# EAGLE design Remote (EAGLE 9.4.2)
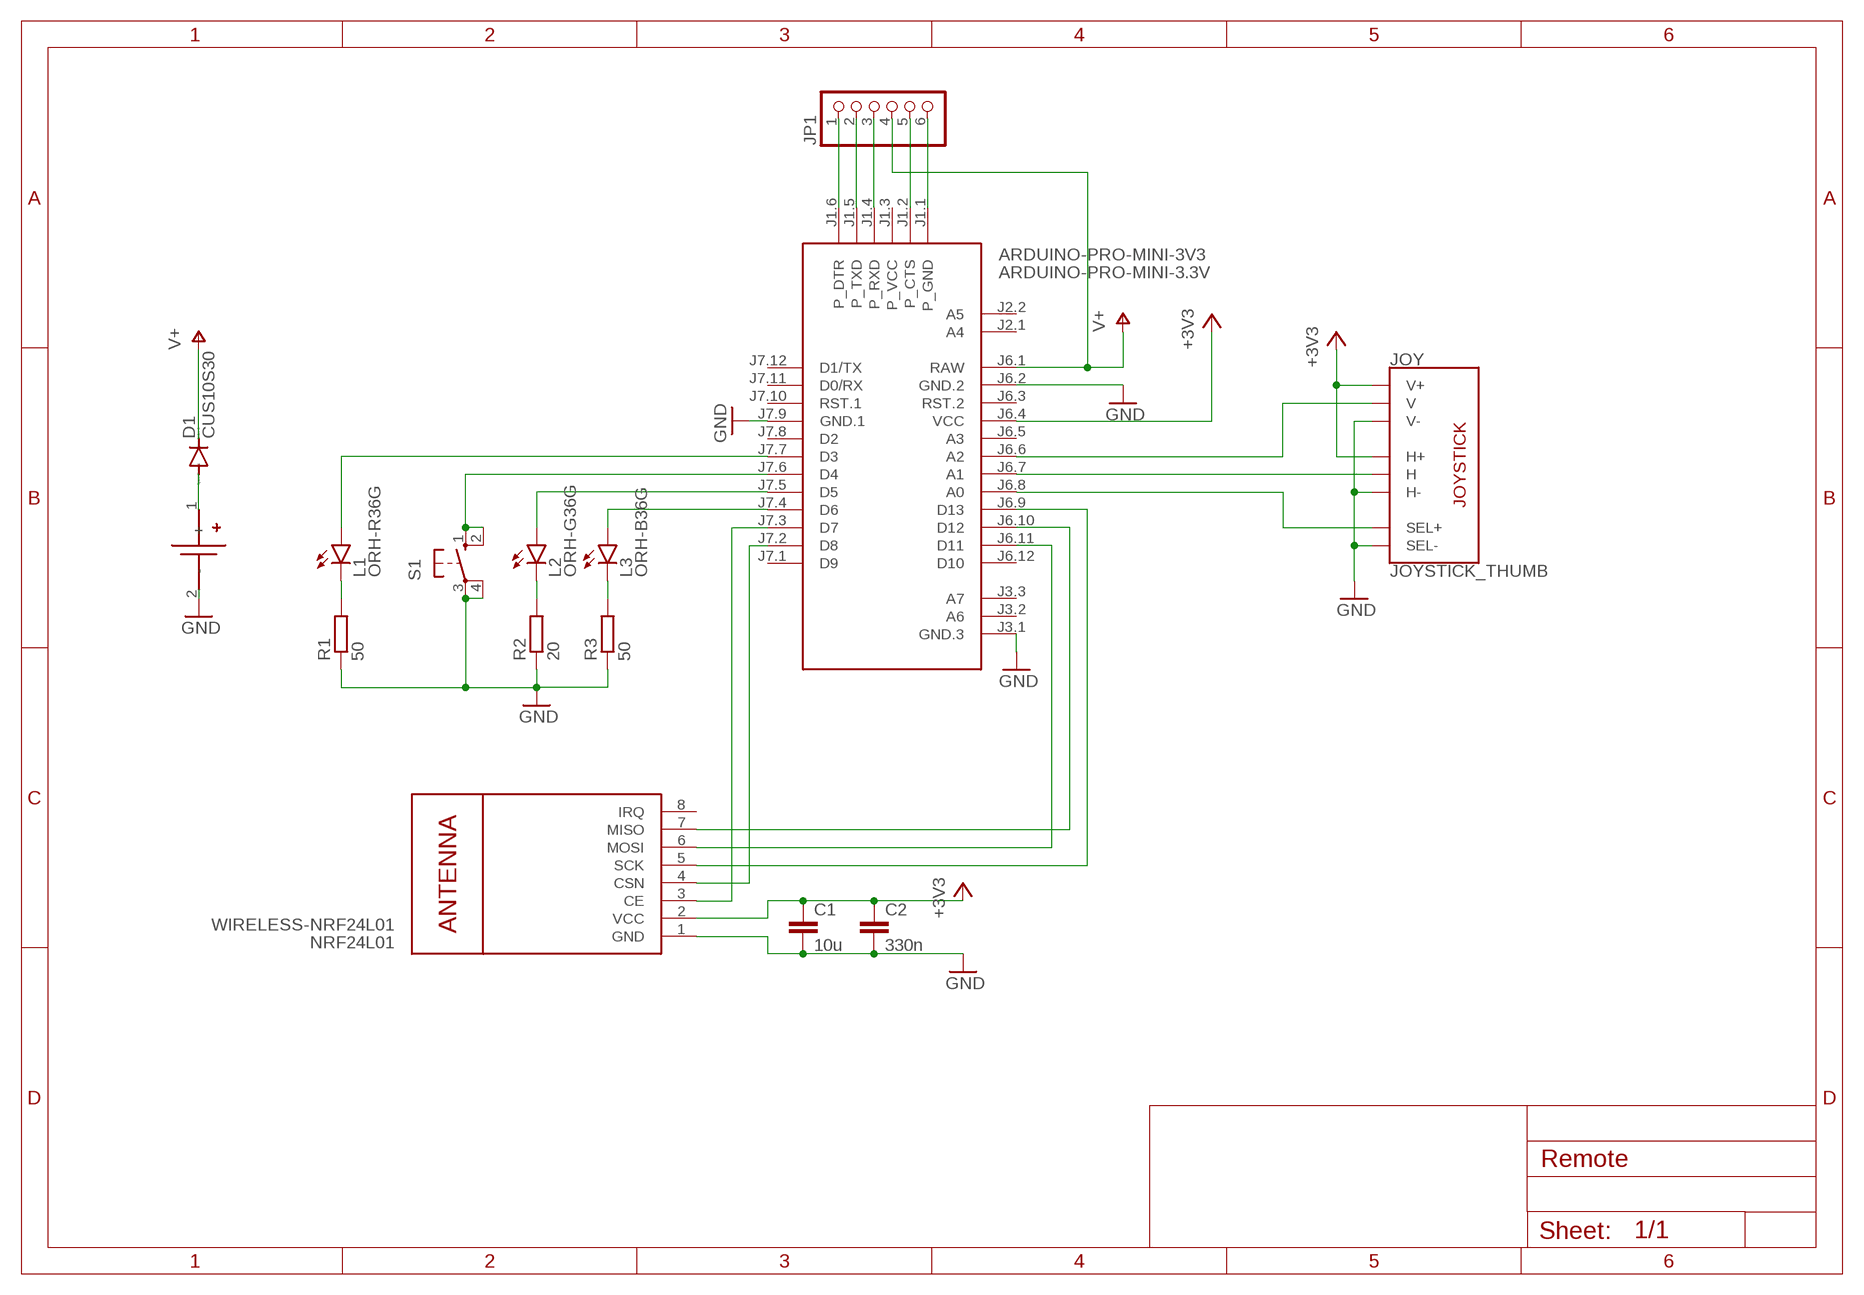
[diagram p0: schematic, sheet 1]

## Parts
ARDUINO-PRO-MINI-3V3  ARDUINO-PRO-MINI-3.3V  [ARDUINO-PRO-MINI]
C1  10u  C-EUC0805  [C0805]
C2  330n  C-EUC0805  [C0805]
D1  CUS10S30  DIODE-SOD323-W  [SOD323-W]
JOY  JOYSTICK_THUMB  [JOYSTICK]
JP1  PINHD-1X6  [1X06]
L1  ORH-R36G  LEDCHIP-LED0603  [CHIP-LED0603]
L2  ORH-G36G  LEDCHIP-LED0603  [CHIP-LED0603]
L3  ORH-B36G  LEDCHIP-LED0603  [CHIP-LED0603]
NRF24L01  WIRELESS-NRF24L01  [WIRELESS-NRF24L01]
R1  50  R-EU_R0603  [R0603]
R2  20  R-EU_R0603  [R0603]
R3  50  R-EU_R0603  [R0603]
S1  10-XX  [B3F-10XX]
U$2  BLOSSOM-BLM-18650-1PCSNO-SCREWS  [BLOSSOM-BLM-18650-1PCS-NO-SCREWS-SMALL-HOLES]

## Nets
+3V3: ARDUINO-PRO-MINI-3V3.J6.4(VCC) C1.1 C2.1 JOY.H1(H+) JOY.V1(V+) NRF24L01.2(VCC)
GND: ARDUINO-PRO-MINI-3V3.J3.1(GND.3) ARDUINO-PRO-MINI-3V3.J6.2(GND.2) ARDUINO-PRO-MINI-3V3.J7.9(GND.1) C1.2 C2.2 JOY.B2A(SEL-) JOY.H3(H-) JOY.V3(V-) NRF24L01.1(GND) R1.1 R2.1 R3.1 S1.3(P) S1.4(P1) U$2.2(-)
N$1: D1.A U$2.1(+)
N$2: ARDUINO-PRO-MINI-3V3.J7.7(D3) L1.A
N$3: ARDUINO-PRO-MINI-3V3.J7.5(D5) L2.A
N$4: ARDUINO-PRO-MINI-3V3.J7.3(D7) NRF24L01.3(CE)
N$5: ARDUINO-PRO-MINI-3V3.J7.2(D8) NRF24L01.4(CSN)
N$6: ARDUINO-PRO-MINI-3V3.J6.9(D13) NRF24L01.5(SCK)
N$7: ARDUINO-PRO-MINI-3V3.J6.11(D11) NRF24L01.6(MOSI)
N$8: ARDUINO-PRO-MINI-3V3.J6.10(D12) NRF24L01.7(MISO)
N$9: ARDUINO-PRO-MINI-3V3.J6.8(A0) JOY.B1A(SEL+)
N$10: ARDUINO-PRO-MINI-3V3.J6.7(A1) JOY.H2(H)
N$11: ARDUINO-PRO-MINI-3V3.J6.6(A2) JOY.V2(V)
N$12: ARDUINO-PRO-MINI-3V3.J7.4(D6) L3.A
N$13: L3.C R3.2
N$14: L2.C R2.2
N$15: L1.C R1.2
N$16: ARDUINO-PRO-MINI-3V3.J1.6(P_DTR) JP1.1
N$17: ARDUINO-PRO-MINI-3V3.J1.5(P_TXD) JP1.2
N$18: ARDUINO-PRO-MINI-3V3.J1.4(P_RXD) JP1.3
N$19: ARDUINO-PRO-MINI-3V3.J7.6(D4) S1.1(S) S1.2(S1)
N$20: ARDUINO-PRO-MINI-3V3.J1.2(P_CTS) JP1.5
N$21: ARDUINO-PRO-MINI-3V3.J1.1(P_GND) JP1.6
V+: ARDUINO-PRO-MINI-3V3.J6.1(RAW) D1.C JP1.4
Unconnected: ARDUINO-PRO-MINI-3V3.J1.3(P_VCC) ARDUINO-PRO-MINI-3V3.J2.1(A4) ARDUINO-PRO-MINI-3V3.J2.2(A5) ARDUINO-PRO-MINI-3V3.J3.2(A6) ARDUINO-PRO-MINI-3V3.J3.3(A7) ARDUINO-PRO-MINI-3V3.J6.3(RST.2) ARDUINO-PRO-MINI-3V3.J6.5(A3) ARDUINO-PRO-MINI-3V3.J6.12(D10) ARDUINO-PRO-MINI-3V3.J7.1(D9) ARDUINO-PRO-MINI-3V3.J7.8(D2) ARDUINO-PRO-MINI-3V3.J7.10(RST.1) ARDUINO-PRO-MINI-3V3.J7.11(D0/RX) ARDUINO-PRO-MINI-3V3.J7.12(D1/TX) NRF24L01.8(IRQ)

## Library data of the parts
ARDUINO-PRO-MINI-3V3 = diy-modules:ARDUINO-PRO-MINI-*: Arduino Pro Mini and compatible devices More details available here: https://www.arduino.cc/en/Main/ArduinoBoardProMini Click here to find device on ebay.com <http://www.ebay.com/sch/arduino+pro+mini>
C1 C2 = rcl:C-EU: CAPACITOR, European symbol; SPICEPREFIX: C
D1 = diode:DIODE-: DIODE
JOY = SparkFun-Switches:JOYSTICK_THUMB: Analog Thumb Joystick This is a joystick very similar to the ‘analog’ joysticks on PS2 (PlayStation 2) controllers. Directional movements are simply two potentiometers - one for each axis. Pots are ~10k each. This joystick also has a select button that is actuated when the joystick is pressed down. SparkFun Products Thumb Joystick <https://www.sparkfun.com/products/9032> (COM-09032) SparkFun Thumb Joystick Breakout <https://www.sparkfun.com/products/9110> (BOB-09110) SparkFun Joystick Shield Kit <https://www.sparkfun.com/products/9760> (DEV-09760); PROD_ID: COMP-09744; SF_SKU: COM-09032
JP1 = pinhead:PINHD-1X6: PIN HEADER
L1-L3 = led:LED: LED OSRAM: - CHIPLED LG R971, LG N971, LY N971, LG Q971, LY Q971, LO R971, LY R971 LH N974, LH R974 LS Q976, LO Q976, LY Q976 LO Q996 - Hyper CHIPLED LW Q18S LB Q993, LB Q99A, LB R99A - SideLED LS A670, LO A670, LY A670, LG A670, LP A670 LB A673, LV A673, LT A673, LW A673 LH A674 LY A675 LS A676, LA A676, LO A676, LY A676, LW A676 LS A679, LY A679, LG A679 - Hyper Micro SIDELED® LS Y876, LA Y876, LO Y876, LY Y876 LT Y87S - SmartLED LW L88C, LW L88S LB L89C, LB L89S, LG L890 LS L89K, LO L89K, LY L89K LS L896, LA L896, LO L896, LY L896 - TOPLED LS T670, LO T670, LY T670, LG T670, LP T670 LSG T670, LSP T670, LSY T670, LOP T670, LYG T670 LG T671, LOG T671, LSG T671 LB T673, LV T673, LT T673, LW T673 LH T674 LS T676, LA T676, LO T676, LY T676, LB T676, LH T676, LSB T676, LW T676 LB T67C, LV T67C, LT T67C, LS T67K, LO T67K, LY T67K, LW E67C LS E67B, LA E67B, LO E67B, LY E67B, LB E67C, LV E67C, LT E67C LW T67C LS T679, LY T679, LG T679 LS T770, LO T770, LY T770, LG T770, LP T770 LB T773, LV T773, LT T773, LW T773 LH T774 LS E675, LA E675, LY E675, LS T675 LS T776, LA T776, LO T776, LY T776, LB T776 LHGB T686 LT T68C, LB T68C - Hyper Mini TOPLED® LB M676 - Mini TOPLED Santana® LG M470 LS M47K, LO M47K, LY M47K Source: http://www.osram.convergy.de LUXEON: - LUMILED® LXK2-PW12-R00, LXK2-PW12-S00, LXK2-PW14-U00, LXK2-PW14-V00 LXK2-PM12-R00, LXK2-PM12-S00, LXK2-PM14-U00 LXK2-PE12-Q00, LXK2-PE12-R00, LXK2-PE12-S00, LXK2-PE14-T00, LXK2-PE14-U00 LXK2-PB12-K00, LXK2-PB12-L00, LXK2-PB12-M00, LXK2-PB14-N00, LXK2-PB14-P00, LXK2-PB14-Q00 LXK2-PR12-L00, LXK2-PR12-M00, LXK2-PR14-Q00, LXK2-PR14-R00 LXK2-PD12-Q00, LXK2-PD12-R00, LXK2-PD12-S00 LXK2-PH12-R00, LXK2-PH12-S00 LXK2-PL12-P00, LXK2-PL12-Q00, LXK2-PL12-R00 Source: www.luxeon.com KINGBRIGHT: KA-3528ASYC Source: www.kingbright.com
NRF24L01 = diy-modules:WIRELESS-NRF24L01: 2.4 GHz Wireless Module based on NRF24L01 chip More details available here: http://www.electrodragon.com/w/NRF24L01 Click here to find device on ebay.com <http://www.ebay.com/sch/nrf24l01+arduino>
R1-R3 = rcl:R-EU_: RESISTOR, European symbol; SPICEPREFIX: R
S1 = switch-omron:10-XX: OMRON SWITCH; MPN: B3F-1000; OC_FARNELL: 176432; OC_NEWARK: 36M3542
U$2 = battery-holders-modified:BLOSSOM-BLM-18650-1PCS

## Board
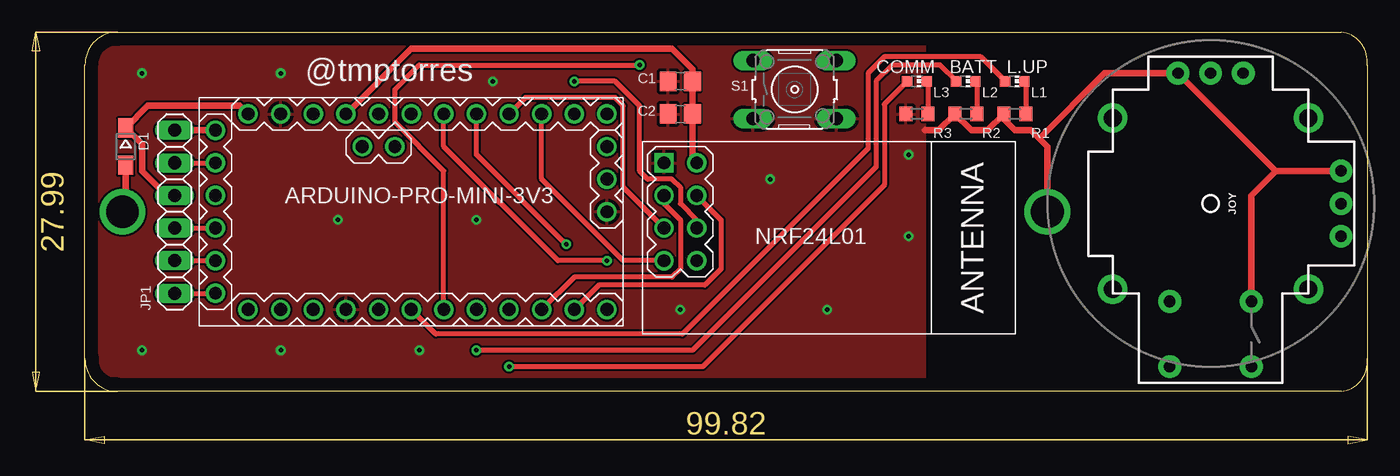
[diagram p1: board, top side]
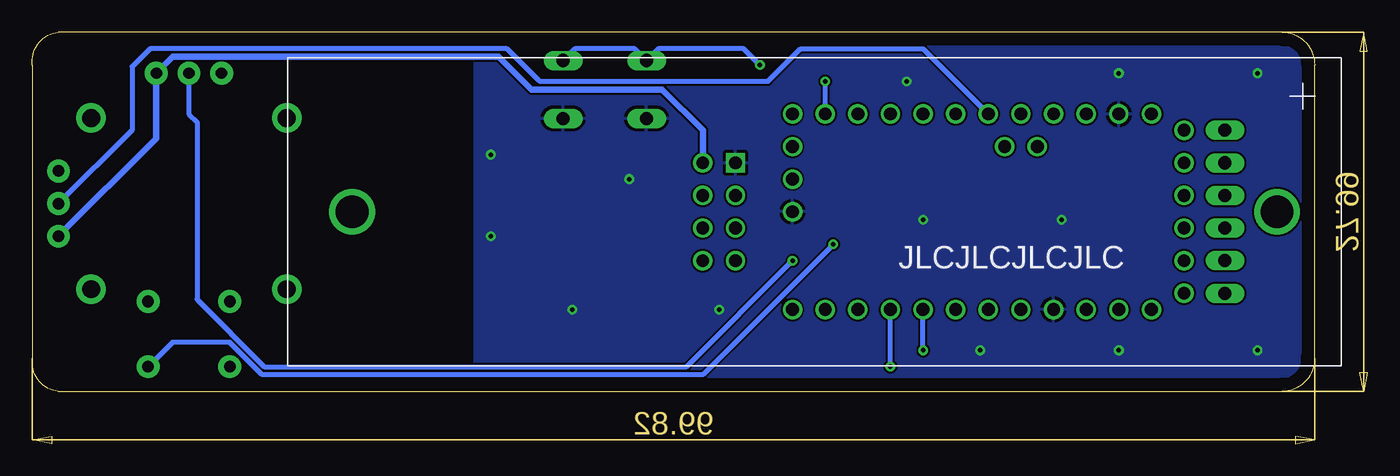
[diagram p2: board, bottom side, seen from below]

Size 99.84 x 27.99 mm. Coordinates in mm from the lower left corner, seen from the top.
Outline: 2.54,27.99 97.79,27.99 arc-90 99.82,25.42 99.82,2.56 arc-90 97.79,0 2.54,0 arc-90 0,2.56 0,25.42 arc-90 2.54,27.99
Copper layers (1*16): Top 0.035mm / dielectric 1.5mm / Bottom 0.035mm
Design rules "default": minimum track width 6mil, minimum drill 0.35mm, track to track 6mil, track to pad 6mil, pad to pad 6mil, via to via 6mil, smd to smd 6mil, copper to edge 40mil, drill to drill 6mil, minimum pad ring 10mil, minimum via ring 8mil, stop-mask expansion 4mil, vias tented up to drill 0mil, thermal gap 10mil

### Footprints (pad centres in the part's own frame; a part is rotated, then mirrored left to right if it is on the bottom)
ARDUINO-PRO-MINI = drill 1: J1.1 -15.24,6.35; J1.2 -15.24,3.81; J1.3 -15.24,1.27; J1.4 -15.24,-1.27; J1.5 -15.24,-3.81; J1.6 -15.24,-6.35; J2.1 -1.27,5.08; J2.2 -3.81,5.08; J3.1 15.24,0; J3.2 15.24,2.54; J3.3 15.24,5.08; J6.1 -12.7,7.62; J6.2 -10.16,7.62; J6.3 -7.62,7.62; J6.4 -5.08,7.62; J6.5 -2.54,7.62; J6.6 0,7.62; J6.7 2.54,7.62; J6.8 5.08,7.62; J6.9 7.62,7.62; J6.10 10.16,7.62; J6.11 12.7,7.62; J6.12 15.24,7.62; J7.1 15.24,-7.62; J7.2 12.7,-7.62; J7.3 10.16,-7.62; J7.4 7.62,-7.62; J7.5 5.08,-7.62; J7.6 2.54,-7.62; J7.7 0,-7.62; J7.8 -2.54,-7.62; J7.9 -5.08,-7.62; J7.10 -7.62,-7.62; J7.11 -10.16,-7.62; J7.12 -12.7,-7.62
C0805 = smd 1.3 x 1.5: 1 -0.95,0; 2 0.95,0
SOD323-W = smd 1.5 x 1.2: A 1.45,0; C -1.45,0
JOYSTICK = drill 0.9 pad 1.778: B1A -3.175,12.7; B1B 3.175,12.7; B2A -3.175,7.62; B2B 3.175,7.62 | drill 0.889 pad 1.778: H1 -2.54,-10.16; H2 0,-10.16; H3 2.54,-10.16; V1 -10.16,2.54; V2 -10.16,0; V3 -10.16,-2.54 | drill 1.397 pad 2.286: MOUNT1 -7.62,6.668; MOUNT2 -7.62,-6.668; MOUNT3 7.62,-6.668; MOUNT4 7.62,6.668
1X06 = drill 1.016 long: 1 -6.35,0; 2 -3.81,0; 3 -1.27,0; 4 1.27,0; 5 3.81,0; 6 6.35,0
CHIP-LED0603 = smd 0.8 x 0.8: A 0,-0.75; C 0,0.75
WIRELESS-NRF24L01 = drill 1 square: 1 -12.7,6.35 | drill 1: 2 -10.16,6.35; 3 -12.7,3.81; 4 -10.16,3.81; 5 -12.7,1.27; 6 -10.16,1.27; 7 -12.7,-1.27; 8 -10.16,-1.27
R0603 = smd 1 x 1.1: 1 -0.85,0; 2 0.85,0
B3F-10XX = drill 1.016 long: 1 -3.251,2.261; 2 3.251,2.261; 3 -3.251,-2.261; 4 3.251,-2.261
BLOSSOM-BLM-18650-1PCS-NO-SCREWS-SMALL-HOLES = drill 2.54: 1 -72,0; 2 0,0

### Placement (x,y rotation side)
ARDUINO-PRO-MINI-3V3  25.4,14 0 top
C1  46.35,24.15 180 top
C2  46.35,21.61 180 top
D1  3.17,19.07 270 top
JOY  87.63,14.63 180 top
JP1  6.99,14 90 top
L1  72.39,24.15 270 top
L2  68.58,24.15 270 top
L3  64.77,24.15 270 top
NRF24L01  57.78,11.46 0 top
R1  72.39,21.61 0 top
R2  68.58,21.61 0 top
R3  64.77,21.61 0 top
S1  55.24,23.52 0 top
U$2  74.93,14 180 bottom

### Tracks (layer width: path | path; a pad name or v marks a point on that pad's centre or on a via)
+3V3
  Top 0.508: ARDUINO-PRO-MINI-3V3.J6.4 25.39,26.68 45.72,26.68 47.3,25.1 C1.1 C2.1 47.3,18.12 NRF24L01.2
  Bottom 0.508: NRF24L01.2 47.62,20.34 50.8,23.52 60.96,23.52 63.52,26.08 88.88,26.08 JOY.H1 90.17,19.71 JOY.V1
GND  (via drill 0.35)
  Top 0.508: U$2.2 74.93,19.07 74.3,19.71 | 74.3,19.71 73.66,20.34 72.39,20.34 71.54,21.2 R1.1 70.27,20.34 69,20.34 R2.1 66.46,20.34 65.41,20.34 | 74.3,19.71 79.38,24.79 JOY.H3 92.71,17.17 | 92.71,17.17 JOY.V3 | JOY.B2A 90.81,15.27 92.71,17.17
  other vias: 26.04,3.2 4.45,24.79 15.24,24.79 31.75,24.15 15.24,3.2 4.45,3.2 46.35,6.38 53.34,16.54 64.14,18.44 64.14,12.09 57.78,6.38 30.48,13.36 19.68,13.36
  pour Top: -0.64,28.6 65.41,28.6 65.41,-0.61 0,-0.61 -0.64,-0.61
  pour Bottom: 65.41,28.6 -0.64,28.6 -0.64,-0.61 65.41,-0.61
N$1
  Top 0.508: U$2.1 3.17,14.24 D1.A
N$2
  Top 0.406: L1.A 69.73,26.06 62.23,26.06 60.96,24.79 60.96,18.92 46.51,4.47 27.3,4.47 ARDUINO-PRO-MINI-3V3.J7.7
N$3  (via drill 0.35)
  Top 0.406: L2.A 66.56,25.42 62.87,25.42 61.59,24.15 61.59,17.49 47.3,3.2 v30.48,3.2
  Bottom 0.406: v30.48,3.2 ARDUINO-PRO-MINI-3V3.J7.5
N$4
  Top 0.406: NRF24L01.3 45.09,14.63 46.35,13.36 46.35,9.55 45.72,8.92 38.1,8.92 ARDUINO-PRO-MINI-3V3.J7.3
N$5
  Top 0.406: NRF24L01.4 49.53,13.36 49.53,9.55 48.26,8.28 40.01,8.28 ARDUINO-PRO-MINI-3V3.J7.2
N$6
  Top 0.406: NRF24L01.5 41.91,15.9 41.91,22.25 41.27,22.88 34.29,22.88 ARDUINO-PRO-MINI-3V3.J6.9
N$7  (via drill 0.35)
  Top 0.406: v38.1,24.15 41.27,24.15 43.18,22.25 43.18,17.17 43.81,16.54 45.72,16.54 46.35,15.9 46.35,14.63 47.62,13.36 NRF24L01.6
  Bottom 0.406: v38.1,24.15 ARDUINO-PRO-MINI-3V3.J6.11
N$8
  Top 0.406: NRF24L01.7 41.91,10.19 35.56,16.54 ARDUINO-PRO-MINI-3V3.J6.10
N$9  (via drill 0.35)
  Top 0.406: v37.47,11.46 30.48,18.44 ARDUINO-PRO-MINI-3V3.J6.8
  Bottom 0.406: v37.47,11.46 47.62,1.29 81.92,1.29 84.45,3.83 88.9,3.83 JOY.B1A
N$10  (via drill 0.35)
  Top 0.406: v40.64,10.19 36.83,10.19 27.94,19.07 ARDUINO-PRO-MINI-3V3.J6.7
  Bottom 0.406: JOY.H2 87.63,21.61 87,20.98 87,7.17 81.76,1.93 48.9,1.93 v40.64,10.19
N$11
  Bottom 0.406: ARDUINO-PRO-MINI-3V3.J6.6 30.48,26.7 40.01,26.7 42.55,24.15 60.33,24.15 62.87,26.7 90.66,26.7 92.05,25.31 92.05,20.37 JOY.V2
N$12  (via drill 0.35)
  Top 0.406: L3.A 62.23,22.36 62.23,16.07 48.09,1.93 v33.02,1.93
  Bottom 0.406: v33.02,1.93 ARDUINO-PRO-MINI-3V3.J7.4
N$13
  Top 0.406: L3.C 65.62,24.05 R3.2
N$14
  Top 0.406: L2.C 69.43,24.05 R2.2
N$15
  Top 0.406: L1.C 73.24,24.05 R1.2
N$16
  Top 0.406: JP1.1 ARDUINO-PRO-MINI-3V3.J1.6
N$17
  Top 0.406: JP1.2 ARDUINO-PRO-MINI-3V3.J1.5
N$18
  Top 0.406: JP1.3 ARDUINO-PRO-MINI-3V3.J1.4
N$19  (via drill 0.35)
  Top 0.406: ARDUINO-PRO-MINI-3V3.J7.6 27.94,17.17 24.13,20.98 24.13,23.52 26.04,25.42 v43.18,25.42
  Bottom 0.406: v43.18,25.42 44.45,26.7 51.08,26.7 S1.1 52.91,26.7 57.58,26.7 S1.2
N$20
  Top 0.406: JP1.5 ARDUINO-PRO-MINI-3V3.J1.2
N$21
  Top 0.508: JP1.6 ARDUINO-PRO-MINI-3V3.J1.1
V+
  Top 0.508: ARDUINO-PRO-MINI-3V3.J6.1 12.06,22.25 4.9,22.25 D1.C 4.45,19.25 4.45,17.17 6.35,15.27 JP1.4

### Text on the board
tNames: COMM | BATT | L.UP | @tmptorres
bNames: JLCJLCJLCJLC